# EAGLE design NSP2D (EAGLE 8.4.0)
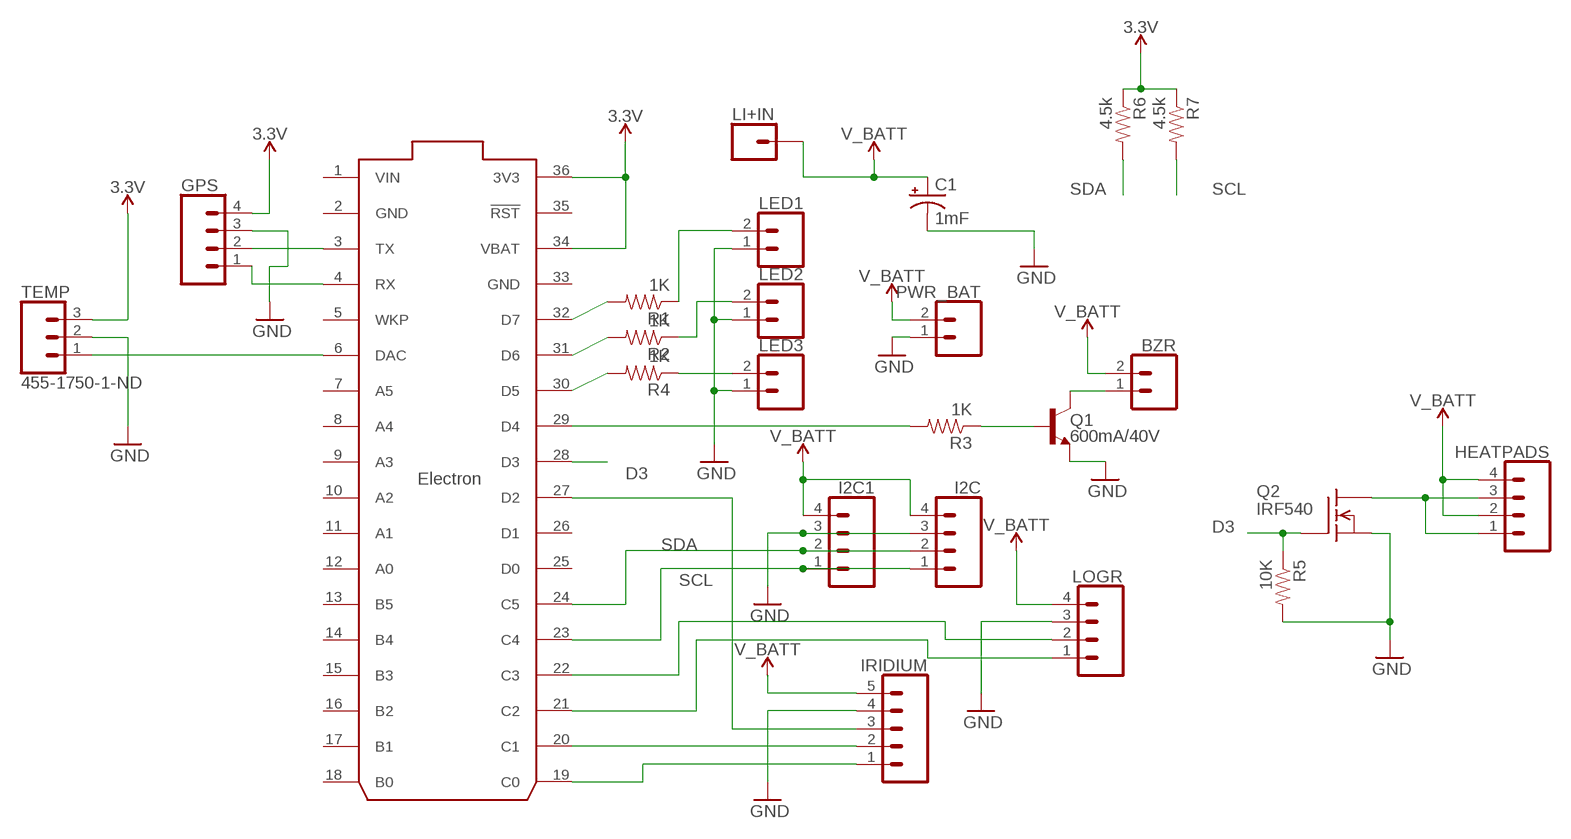
[diagram p0: schematic, sheet 1]

## Parts
BZR  CONN_02  [1X02]
C1  1mF  1000UF-RADIAL-5MM-25V-20%  [CPOL-RADIAL-5MM-10MM]
GPS  CONN_04  [1X04]
HEATPADS  CONN_04  [1X04]
I2C  CONN_04  [1X04]
I2C1  CONN_04  [1X04]
IRIDIUM  CONN_05  [1X05]
LED1  CONN_02  [1X02]
LED2  CONN_02  [1X02]
LED3  CONN_02  [1X02]
LI+IN  CONN_01  [1X01]
LOGR  CONN_04  [1X04]
MCU  ELECTRON  ELECTRON_WITH_HEADERS  [ELECTRON]
PWR_BAT  CONN_02  [1X02]
Q1  600mA/40V  TRANS_NPN-P2N2222A  [TO-92]
Q2  IRF540  [TO220]
R1  1K  RESISTORPTH-1/6W  [1/6W-RES]
R2  1K  RESISTORPTH-1/6W  [1/6W-RES]
R3  1K  RESISTORPTH-1/6W  [1/6W-RES]
R4  1K  RESISTORPTH-1/6W  [1/6W-RES]
R5  10K  RESISTORPTH-1/6W  [1/6W-RES]
R6  4.5k  RESISTORPTH-1/6W  [1/6W-RES]
R7  4.5k  RESISTORPTH-1/6W  [1/6W-RES]
TEMP  455-1750-1-ND  CONN_03  [1X03]

## Nets
3.3V: GPS.4 MCU.34(VBAT) MCU.36(3V3) R6.1 R7.1 TEMP.3
D3: MCU.28(D3) Q2.1(G) R5.1
GND: C1.- GPS.3 I2C1.3 I2C.3 IRIDIUM.4 LED1.1 LED2.1 LED3.1 LOGR.3 PWR_BAT.1 Q1.3(E) Q2.3(S) R5.2 TEMP.2
IRWKP: IRIDIUM.3 MCU.27(D2)
N$1: MCU.6(DAC) TEMP.1
N$2: GPS.2 MCU.3(TX)
N$3: MCU.32(D7) R1.2
N$4: Q1.2(B) R3.1
N$5: MCU.29(D4) R3.2
N$8: LED1.2 R1.1
N$9: BZR.1 Q1.1(C)
N$11: HEATPADS.1 HEATPADS.3 Q2.2(D)
N$12: GPS.1 MCU.4(RX)
N$13: MCU.31(D6) R2.2
N$14: IRIDIUM.2 MCU.20(C1)
N$16: LED2.2 R2.1
N$18: MCU.30(D5) R4.2
N$19: LED3.2 R4.1
SCL: I2C1.1 I2C.1 MCU.23(C4) R7.2
SDA: I2C1.2 I2C.2 MCU.24(C5) R6.2
UART4_RX: LOGR.1 MCU.21(C2)
UART4_TX: LOGR.2 MCU.22(C3)
UART5_RX: IRIDIUM.1 MCU.19(C0)
V_BATT: BZR.2 C1.+ HEATPADS.2 HEATPADS.4 I2C1.4 I2C.4 IRIDIUM.5 LI+IN.1 LOGR.4 PWR_BAT.2
Unconnected: MCU.5(WKP) MCU.7(A5) MCU.8(A4) MCU.9(A3) MCU.10(A2) MCU.11(A1) MCU.12(A0) MCU.13(B5) MCU.14(B4) MCU.15(B3) MCU.16(B2) MCU.17(B1) MCU.18(B0) MCU.25(D0) MCU.26(D1) MCU.35(!RST)

## Power pins joined to a net without a drawn wire
GND: MCU.2(GND) MCU.33(GND)
VIN: MCU.1(VIN)

## Library data of the parts
BZR LED1-LED3 PWR_BAT = SparkFun-Connectors:CONN_02: Multi connection point. Often used as Generic Header-pin footprint for 0.1 inch spaced/style header connections On any of the 0.1 inch spaced packages, you can populate with these: Break Away Headers - Straight <https://www.sparkfun.com/products/116> (PRT-00116) Break Away Male Headers - Right Angle <https://www.sparkfun.com/products/553> (PRT-00553) Female Headers <https://www.sparkfun.com/products/115> (PRT-00115) Break Away Headers - Machine Pin <https://www.sparkfun.com/products/117> (PRT-00117) Break Away Female Headers - Swiss Machine Pin <https://www.sparkfun.com/products/743> (PRT-00743) For SCREWTERMINALS and SPRING TERMINALS visit here: Screw Terimnals on SparkFun.com <https://www.sparkfun.com/search/results?term=Screw+Terminals> (5mm/3.5mm/2.54mm spacing) This device is also useful as a general connection point to wire up your design to another part of your project. Our various solder wires solder well into these plated through hole pads. Hook-Up Wire - Assortment (Stranded, 22 AWG) <https://www.sparkfun.com/products/11375> (PRT-11375) Hook-Up Wire - Assortment (Solid Core, 22 AWG) <https://www.sparkfun.com/products/11367> (PRT-11367) View the entire wire category on our website here <https://www.sparkfun.com/categories/141> Special notes: Molex polarized connector foot print use with: PRT-08233 with associated crimp pins and housings. 2.54_SCREWTERM for use with PRT-10571. 3.5mm Screw Terminal footprints for PRT-08084 5mm Screw Terminal footprints for use with PRT-08432
C1 = SparkFun-Capacitors:1000UF: 1,000µF/1mF ceramic capacitors A capacitor is a passive two-terminal electrical component used to store electrical energy temporarily in an electric field. CAP-08070; PROD_ID: CAP-09538
GPS HEATPADS I2C I2C1 LOGR = SparkFun-Connectors:CONN_04: Multi connection point. Often used as Generic Header-pin footprint for 0.1 inch spaced/style header connections On any of the 0.1 inch spaced packages, you can populate with these: Break Away Headers - Straight <https://www.sparkfun.com/products/116> (PRT-00116) Break Away Male Headers - Right Angle <https://www.sparkfun.com/products/553> (PRT-00553) Female Headers <https://www.sparkfun.com/products/115> (PRT-00115) Break Away Headers - Machine Pin <https://www.sparkfun.com/products/117> (PRT-00117) Break Away Female Headers - Swiss Machine Pin <https://www.sparkfun.com/products/743> (PRT-00743) For SCREWTERMINALS and SPRING TERMINALS visit here: Screw Terimnals on SparkFun.com <https://www.sparkfun.com/search/results?term=Screw+Terminals> (5mm/3.5mm/2.54mm spacing) This device is also useful as a general connection point to wire up your design to another part of your project. Our various solder wires solder well into these plated through hole pads. Hook-Up Wire - Assortment (Stranded, 22 AWG) <https://www.sparkfun.com/products/11375> (PRT-11375) Hook-Up Wire - Assortment (Solid Core, 22 AWG) <https://www.sparkfun.com/products/11367> (PRT-11367) View the entire wire category on our website here <https://www.sparkfun.com/categories/141> Special notes: Molex polarized connector foot print use with SKU : PRT-08231 with associated crimp pins and housings. 1MM SMD Version SKU: PRT-10208; PROD_ID: CONN-09696
IRIDIUM = SparkFun-Connectors:CONN_05: Multi connection point. Often used as Generic Header-pin footprint for 0.1 inch spaced/style header connections On any of the 0.1 inch spaced packages, you can populate with these: Break Away Headers - Straight <https://www.sparkfun.com/products/116> (PRT-00116) Break Away Male Headers - Right Angle <https://www.sparkfun.com/products/553> (PRT-00553) Female Headers <https://www.sparkfun.com/products/115> (PRT-00115) Break Away Headers - Machine Pin <https://www.sparkfun.com/products/117> (PRT-00117) Break Away Female Headers - Swiss Machine Pin <https://www.sparkfun.com/products/743> (PRT-00743) For SCREWTERMINALS and SPRING TERMINALS visit here: Screw Terimnals on SparkFun.com <https://www.sparkfun.com/search/results?term=Screw+Terminals> (5mm/3.5mm/2.54mm spacing) This device is also useful as a general connection point to wire up your design to another part of your project. Our various solder wires solder well into these plated through hole pads. Hook-Up Wire - Assortment (Stranded, 22 AWG) <https://www.sparkfun.com/products/11375> (PRT-11375) Hook-Up Wire - Assortment (Solid Core, 22 AWG) <https://www.sparkfun.com/products/11367> (PRT-11367) View the entire wire category on our website here <https://www.sparkfun.com/categories/141> Special notes: Molex polarized connector foot print use with SKU : PRT-08231 with associated crimp pins and housings. 1MM SMD Version SKU: PRT-10208
LI+IN = SparkFun-Connectors:CONN_01: Single connection point. Often used as Generic Header-pin footprint for 0.1 inch spaced/style header connections On any of the 0.1 inch spaced packages, you can populate with these: Break Away Headers - Straight <https://www.sparkfun.com/products/116> (PRT-00116) Break Away Male Headers - Right Angle <https://www.sparkfun.com/products/553> (PRT-00553) Female Headers <https://www.sparkfun.com/products/115> (PRT-00115) Break Away Headers - Machine Pin <https://www.sparkfun.com/products/117> (PRT-00117) Break Away Female Headers - Swiss Machine Pin <https://www.sparkfun.com/products/743> (PRT-00743) This device is also useful as a general connection point to wire up your design to another part of your project. Our various solder wires solder well into these plated through hole pads. Hook-Up Wire - Assortment (Stranded, 22 AWG) <https://www.sparkfun.com/products/11375> (PRT-11375) Hook-Up Wire - Assortment (Solid Core, 22 AWG) <https://www.sparkfun.com/products/11367> (PRT-11367) View the entire wire category on our website here <https://www.sparkfun.com/categories/141> Special notes: SMTSO-256-ET is a "flush mount" nut for a 4-40 screw. We mostly use this on specialty testbeds; it is a nice way to connect hardware to your PCB at an adjustable hieght. Also note, the SNAP packages are for using a snappable style connector. We sell a baggie of snaps and they are also used on two LilyPad designs: Snap Assortment - 30 pack (male and female) <https://www.sparkfun.com/products/11347> (DEV-11347) LilyPad Arduino SimpleSnap <https://www.sparkfun.com/products/10941> (DEV-10941) LilyPad SimpleSnap Protoboard <https://www.sparkfun.com/products/10940> (DEV-10940)
MCU = Particle-Devices:ELECTRON: Particle Electron footprint
Q1 = SparkFun-DiscreteSemi:TRANS_NPN: NPN transistor Current controlled devices typically used to amplify current or used as a switch. BC547 - COM-08928 <http://www.sparkfun.com/products/8928> (TO-92 45V 100mA) (1.Collector 2.Base 3.Emitter) 2N3904 - COM-00521 <http://www.sparkfun.com/products/521> (TO-92 40V 200mA) (1.Emitter 2.Base 3.Collector) P2N2222A - COM-12852 <http://www.sparkfun.com/products/12852> (TO-92 40V 600mA) (1.Collector 2.Base 3.Emitter); PROD_ID: TRANS-09536
Q2 = transistor-fet:IRF540: N-Channel Enhancement MOSFET (HEXFET); 100V; 28A; 0,077Ohm
R1-R7 = SparkFun-Passives:RESISTOR: Resistor Basic schematic elements and footprints for 0603, 1206, and PTH resistors.
TEMP = SparkFun-Connectors:CONN_03: Multi connection point. Often used as Generic Header-pin footprint for 0.1 inch spaced/style header connections On any of the 0.1 inch spaced packages, you can populate with these: Break Away Headers - Straight <https://www.sparkfun.com/products/116> (PRT-00116) Break Away Male Headers - Right Angle <https://www.sparkfun.com/products/553> (PRT-00553) Female Headers <https://www.sparkfun.com/products/115> (PRT-00115) Break Away Headers - Machine Pin <https://www.sparkfun.com/products/117> (PRT-00117) Break Away Female Headers - Swiss Machine Pin <https://www.sparkfun.com/products/743> (PRT-00743) Stackable Header - 3 Pin (Female, 0.1") <https://www.sparkfun.com/products/13875> (PRT-13875) For SCREWTERMINALS and SPRING TERMINALS visit here: Screw Terimnals on SparkFun.com <https://www.sparkfun.com/search/results?term=Screw+Terminals> (5mm/3.5mm/2.54mm spacing) This device is also useful as a general connection point to wire up your design to another part of your project. Our various solder wires solder well into these plated through hole pads. Hook-Up Wire - Assortment (Stranded, 22 AWG) <https://www.sparkfun.com/products/11375> (PRT-11375) Hook-Up Wire - Assortment (Solid Core, 22 AWG) <https://www.sparkfun.com/products/11367> (PRT-11367) View the entire wire category on our website here <https://www.sparkfun.com/categories/141> Special notes: Molex polarized connector foot print use with SKU : PRT-08232 with associated crimp pins and housings.; PROD_ID: XXX-00000

## Board
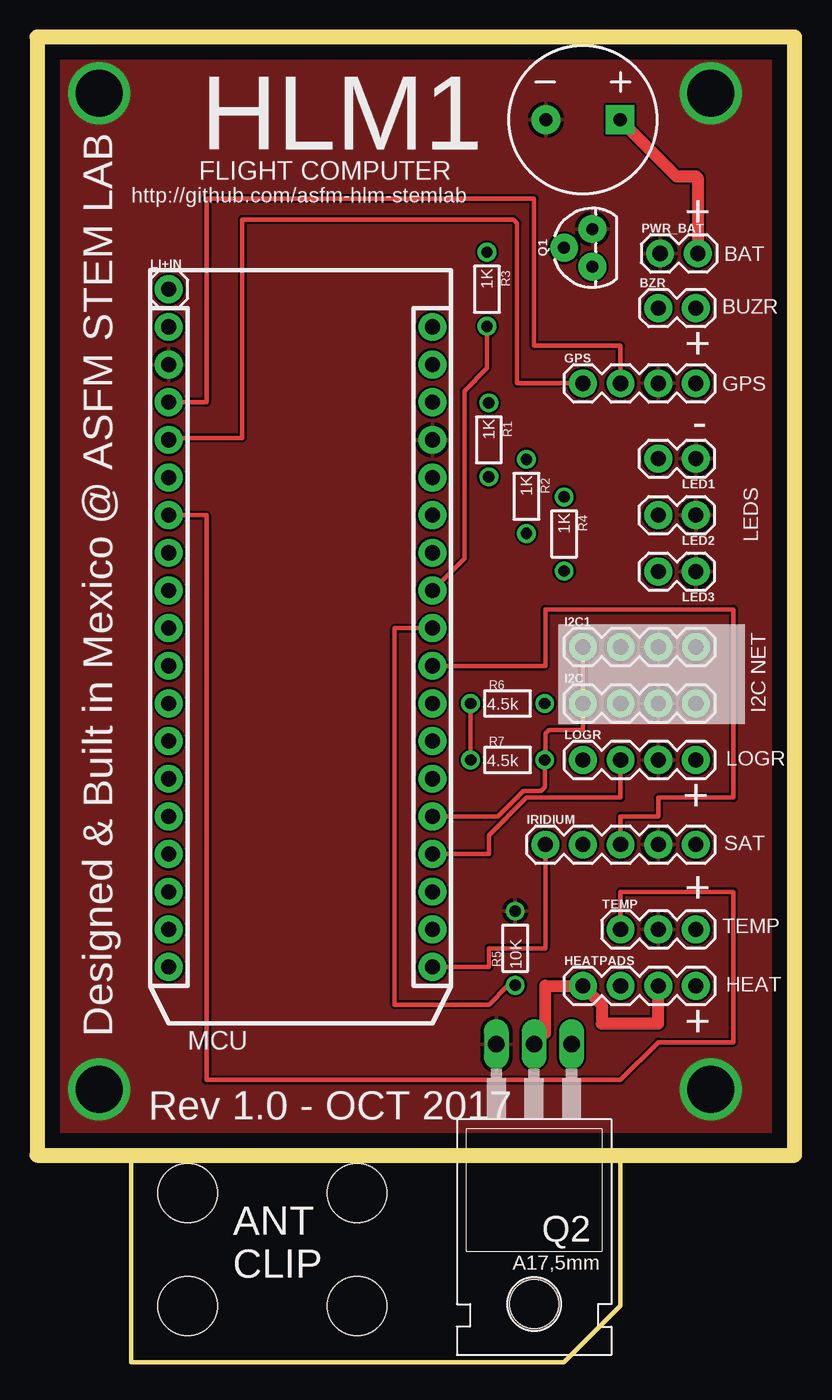
[diagram p1: board, top side]
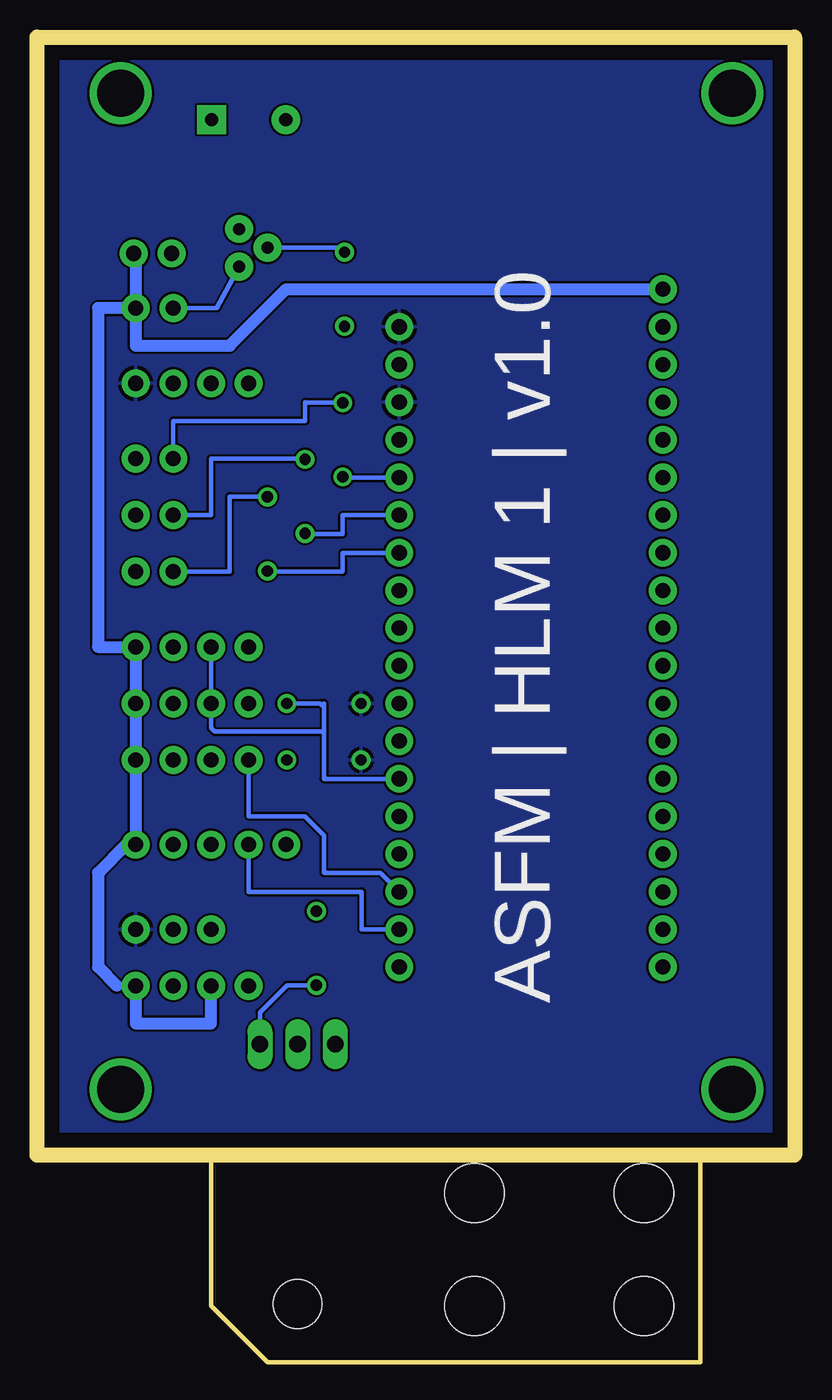
[diagram p2: board, bottom side, seen from below]

Size 51.1 x 89.4 mm. Coordinates in mm from the lower left corner, seen from the top.
Outline: 0,13.97 51.1,13.97 51.1,89.4 0,89.4 0,13.97
Copper layers (1*16): Top 0.035mm / dielectric 1.5mm / Bottom 0.035mm
Design rules "default": minimum track width 6mil, minimum drill 0.35mm, track to track 6mil, track to pad 6mil, pad to pad 6mil, via to via 6mil, smd to smd 6mil, copper to edge 40mil, drill to drill 6mil, minimum pad ring 10mil, minimum via ring 8mil, stop-mask expansion 4mil, vias tented up to drill 0mil, thermal gap 10mil
Holes 4 mm at 21.59,11.43 21.59,3.81 10.16,3.81 10.16,11.43

### Footprints (pad centres in the part's own frame; a part is rotated, then mirrored left to right if it is on the bottom)
1X02 = drill 1.016 pad 1.88: 1 0,0; 2 2.54,0
CPOL-RADIAL-5MM-10MM = drill 0.9 pad 1.93 square: + 2.5,0 | drill 0.9 pad 1.93: - -2.5,0
1X04 = drill 1.016 pad 1.88: 1 0,0; 2 2.54,0; 3 5.08,0; 4 7.62,0
1X05 = drill 1.016 pad 1.88: 1 0,0; 2 2.54,0; 3 5.08,0; 4 7.62,0; 5 10.16,0
1X01 = drill 1.016 pad 1.88: 1 0,0
ELECTRON = drill 1.016 pad 1.88: 1 1.27,46.99; 2 1.27,44.45; 3 1.27,41.91; 4 1.27,39.37; 5 1.27,36.83; 6 1.27,34.29; 7 1.27,31.75; 8 1.27,29.21; 9 1.27,26.67; 10 1.27,24.13; 11 1.27,21.59; 12 1.27,19.05; 13 1.27,16.51; 14 1.27,13.97; 15 1.27,11.43; 16 1.27,8.89; 17 1.27,6.35; 18 1.27,3.81; 19 19.05,3.81; 20 19.05,6.35; 21 19.05,8.89; 22 19.05,11.43; 23 19.05,13.97; 24 19.05,16.51; 25 19.05,19.05; 26 19.05,21.59; 27 19.05,24.13; 28 19.05,26.67; 29 19.05,29.21; 30 19.05,31.75; 31 19.05,34.29; 32 19.05,36.83; 33 19.05,39.37; 34 19.05,41.91; 35 19.05,44.45; 36 19.05,46.99
TO-92 = drill 0.813 pad 1.88: 1 -1.27,0; 2 0,1.905; 3 1.27,0
TO220 = drill 1.118 long: 1 -2.54,-6.35; 2 0,-6.35; 3 2.54,-6.35 | hole 3.302: 0,11.176
1/6W-RES = drill 0.762: 1 -2.5,0; 2 2.5,0
1X03 = drill 1.016 pad 1.88: 1 0,0; 2 2.54,0; 3 5.08,0

### Placement (x,y rotation side)
BZR  41.91,71.12 0 top
C1  36.83,83.82 0 top
GPS  36.83,66.04 0 top
HEATPADS  36.83,25.4 0 top
I2C  36.83,44.45 0 top
I2C1  36.83,48.26 0 top
IRIDIUM  34.29,34.92 0 top
LED1  44.45,60.96 180 top
LED2  44.45,57.15 180 top
LED3  44.45,53.34 180 top
LI+IN  8.89,72.39 0 top
LOGR  36.83,40.64 0 top
MCU  7.62,22.86 0 top
PWR_BAT  42.04,74.8 0 top
Q1  37.47,75.18 90 top
Q2  33.53,15.11 180 top
R1  30.48,62.23 270 top
R2  33.02,58.42 270 top
R3  30.35,72.39 270 top
R4  35.56,55.88 270 top
R5  32.26,27.94 90 top
R6  31.75,44.45 0 top
R7  31.75,40.64 0 top
TEMP  39.37,29.21 0 top

### Tracks (layer width: path | path; a pad name or v marks a point on that pad's centre or on a via)
3.3V
  Top 0.305: R7.1 R6.1
  pour Bottom: 0,90.17 54.61,90.17 54.61,2.54 0,2.54
D3
  Top 0.305: R5.1 32.22,25.4 31.75,25.4 30.48,24.13 24.13,24.13 24.13,49.53 MCU.28
  Bottom 0.305: Q2.1 36.07,23.62 34.25,25.44 R5.1 31.79,25.44
GND  (via drill 3.17)
  other vias: 4.19,85.6 45.47,85.6 45.47,18.41 4.19,18.41
  pour Top: 0,90.17 -1.27,2.54 53.34,3.81 54.61,91.44
IRWKP
  Top 0.305: MCU.27 34.29,46.99 34.29,50.8 46.99,50.8 46.99,38.1 41.91,38.1 41.91,36.83 39.37,36.83 IRIDIUM.3
N$1
  Top 0.305: MCU.6 11.43,57.15 11.43,19.05 39.37,19.05 41.91,21.59 46.99,21.59 46.99,31.75 39.37,31.75 TEMP.1
N$2
  Top 0.305: GPS.2 39.37,68.58 33.53,68.58 33.53,78.49 11.43,78.49 11.43,64.77 MCU.3
N$3
  Bottom 0.305: R1.2 30.44,59.69 MCU.32
N$4
  Bottom 0.305: R3.1 30.65,75.18 Q1.2
N$5
  Top 0.305: R3.2 30.35,67.06 28.83,65.53 28.83,54.23 MCU.29
N$8
  Bottom 0.305: R1.1 32.98,64.73 33.02,64.77 33.02,63.5 41.91,63.5 LED1.2
N$9
  Bottom 0.305: Q1.1 38.99,71.12 BZR.1
N$11
  Top 0.305: Q2.2 34.29,22.23
  Top 0.813: 34.29,22.23 34.29,25.4 HEATPADS.1 38.1,24.13 38.1,22.86 41.91,22.86 HEATPADS.3
N$12
  Top 0.305: GPS.1 32.38,66.04 32.38,76.84 32.13,77.09 13.84,77.09 13.84,62.36 9.02,62.36 MCU.4
N$13
  Bottom 0.305: R2.2 32.98,55.88 30.48,55.88 30.48,57.15 MCU.31
N$14
  Bottom 0.305: IRIDIUM.2 36.83,31.75 29.21,31.75 29.21,29.21 MCU.20
N$16
  Bottom 0.305: LED2.2 39.37,57.15 39.37,60.96 33.06,60.96 R2.1
N$18
  Bottom 0.305: MCU.30 30.48,54.61 30.48,53.34 35.52,53.34 R4.2
N$19
  Bottom 0.305: R4.1 35.6,58.42 38.1,58.42 38.1,53.34 LED3.2
SCL
  Top 0.305: MCU.23 31.1,36.83 32.83,38.56 33.98,38.56 34.25,38.82 R7.2 34.29,40.68 34.29,42.42 34.54,42.67 36.83,42.67 I2C.1 I2C1.1
SDA
  Bottom 0.305: 31.75,42.42 31.88,42.54 39.12,42.54 39.37,42.8 I2C.2 I2C1.2 | 31.75,42.42 31.75,39.37 MCU.24 | R6.2 32,44.45 31.88,44.32 31.75,44.45 31.75,42.42
UART4_RX
  Bottom 0.305: MCU.21 27.94,33.02 31.75,33.02 31.75,35.56 33.02,36.83 36.83,36.83 LOGR.1
UART4_TX
  Top 0.305: LOGR.2 39.37,38.1 33.02,38.1 30.48,35.56 30.48,34.29 MCU.22
UART5_RX
  Top 0.305: IRIDIUM.1 34.29,27.94 30.48,27.94 30.48,26.67 MCU.19
V_BATT
  Top 0.813: C1.+ 43.14,80.01 44.45,80.01 44.58,79.88 PWR_BAT.2
  Bottom 0.305: PWR_BAT.2 44.45,74.68 | IRIDIUM.5 45.09,34.92 | 45.72,25.4 HEATPADS.4
  Bottom 0.813: 44.45,74.68 BZR.2 | BZR.2 44.45,68.58 38.1,68.58 34.29,72.39 LI+IN.1 | BZR.2 46.99,71.12 46.99,48.26 I2C1.4 I2C.4 LOGR.4 IRIDIUM.5 | 45.09,34.92 46.99,33.02 46.99,26.67 45.72,25.4 | HEATPADS.4 44.45,22.86 39.37,22.86 HEATPADS.2

### Text on the board
tPlace: HLM1 | FLIGHT COMPUTER | http://github.com/asfm-hlm-stemlab | + | BAT | BUZR | + | GPS | - | LEDS | I2C NET | LOGR | + | SAT | + | TEMP | HEAT | Designed & Built in Mexico @ ASFM STEM LAB | + | Rev 1.0 - OCT 2017 | ANT / CLIP
bPlace: ASFM | HLM 1 | v1.0